# Altium project 20211009_EleksTube_IPS_V1.2.PrjPCB
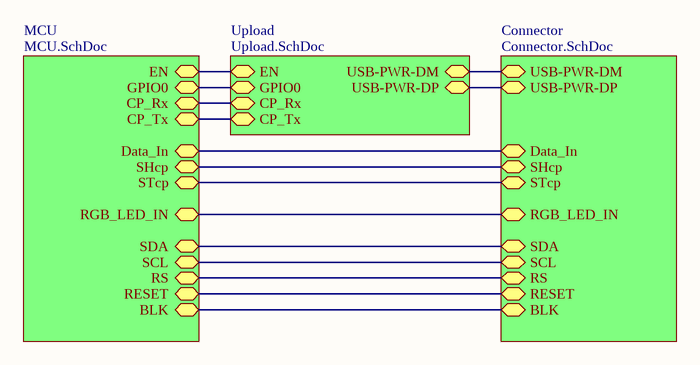
[diagram p0: 20211009_EleksTube_IPS_V1.2.SchDoc]
4 sheets, 43 parts. Net scope: hierarchical (ports join the sheet entries above them; power ports are global).
Board file: 20211009_EleksTube_IPS_V1.2.PcbDoc
Sheets:
  20211009_EleksTube_IPS_V1.2.SchDoc
    MCU = MCU.SchDoc
    Connector = Connector.SchDoc
    Upload = Upload.SchDoc

## Sheet 20211009_EleksTube_IPS_V1.2.SchDoc
size A4

### Sub-sheets
Connector = Connector.SchDoc: USB-PWR-DM, USB-PWR-DP, SDA, SCL, RS, RESET, Data_In, SHcp, STcp, RGB_LED_IN, BLK
MCU = MCU.SchDoc: EN, GPIO0, CP_Rx, CP_Tx, Data_In, SHcp, STcp, SDA, SCL, RS, RESET, RGB_LED_IN, BLK
Upload = Upload.SchDoc: EN, GPIO0, USB-PWR-DM, USB-PWR-DP, CP_Rx, CP_Tx

### Nets
BLK: sheet MCU/BLK, sheet Connector/BLK
CP_Rx: sheet MCU/CP_Rx, sheet Upload/CP_Rx
CP_Tx: sheet MCU/CP_Tx, sheet Upload/CP_Tx
Data_In: sheet MCU/Data_In, sheet Connector/Data_In
DC: sheet MCU/RS, sheet Connector/RS
EN: sheet MCU/EN, sheet Upload/EN
GPIO0: sheet MCU/GPIO0, sheet Upload/GPIO0
GPIO12: sheet MCU/RGB_LED_IN, sheet Connector/RGB_LED_IN
GPIO16: sheet MCU/SHcp, sheet Connector/SHcp
GPIO17: sheet MCU/STcp, sheet Connector/STcp
GPIO18: sheet MCU/SCL, sheet Connector/SCL
GPIO23: sheet MCU/SDA, sheet Connector/SDA
GPIO26: sheet MCU/RESET, sheet Connector/RESET
USB-PWR-DM: sheet Connector/USB-PWR-DM, sheet Upload/USB-PWR-DM
USB-PWR-DP: sheet Connector/USB-PWR-DP, sheet Upload/USB-PWR-DP

## Sheet MCU.SchDoc
size A4
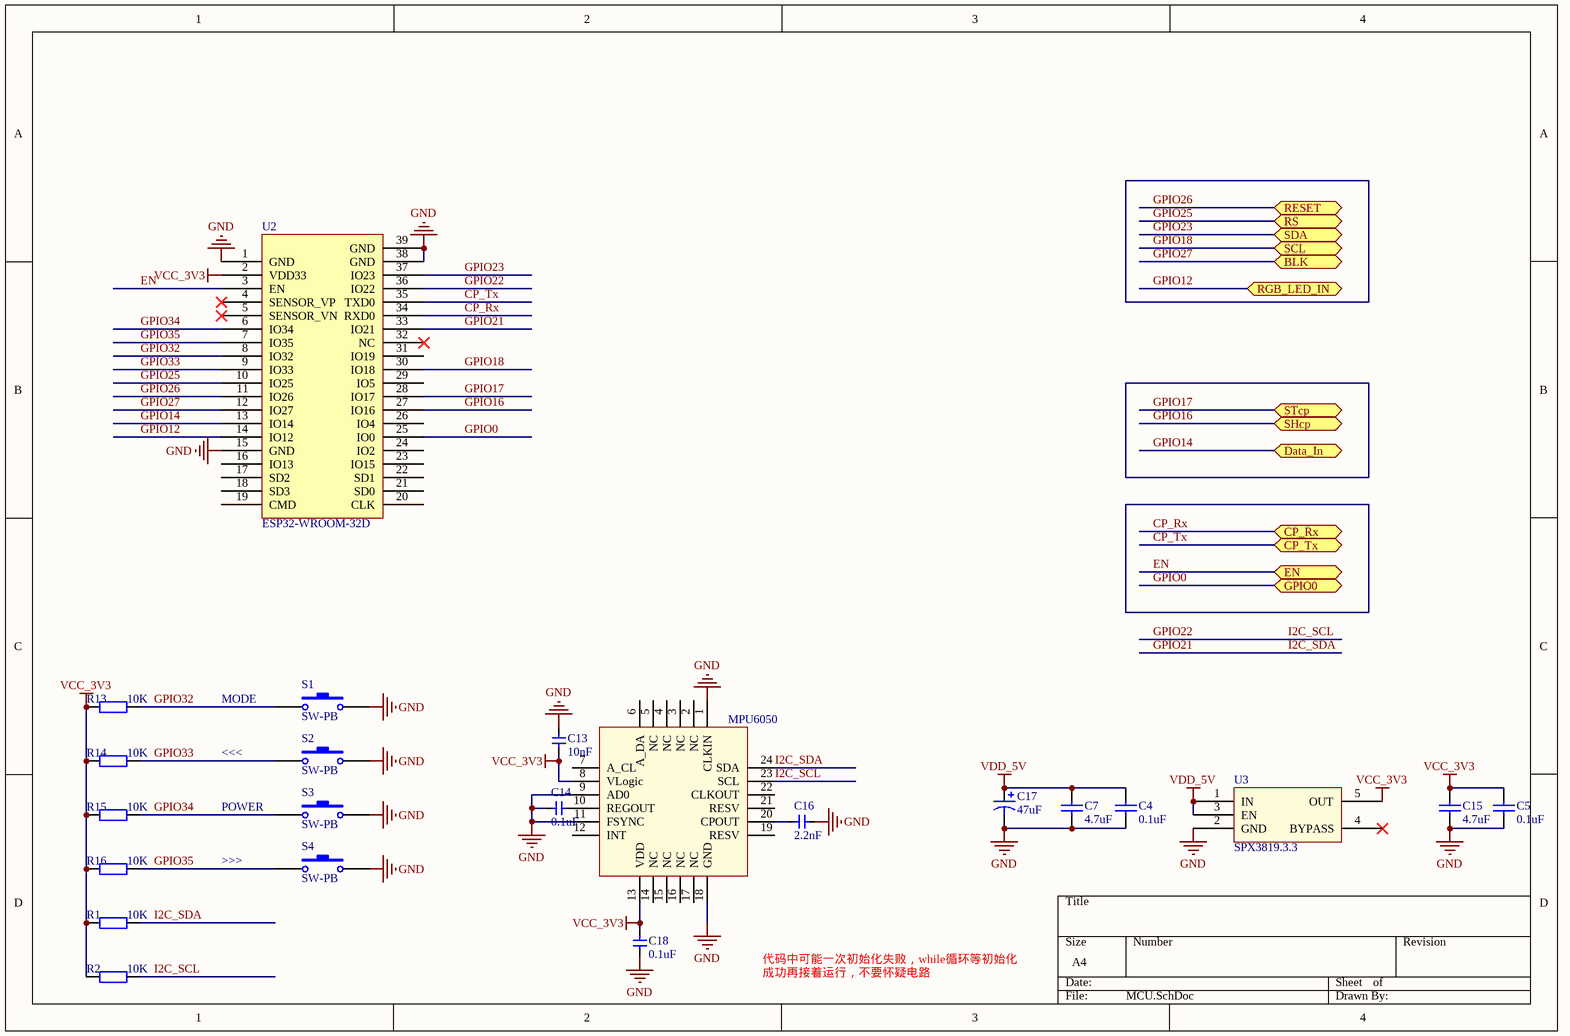
[diagram p1: MCU.SchDoc]

### Parts
C4  0.1uF  [C0603]
C5  0.1uF  [C0603]
C7  4.7uF  [C0603]
C13  10nF  [C0603]
C14  0.1uF  [C0603]
C15  4.7uF  [C0603]
C16  2.2nF  [C0603]
C17  47uF  [6032-C/P]
C18  0.1uF  [C0603]
R1  10K  [R0603]
R2  10K  [R0603]
R13  10K  [R0603]
R14  10K  [R0603]
R15  10K  [R0603]
R16  10K  [R0603]
S1  SW-PB  [6*6*6]
S2  SW-PB  [6*6*6]
S3  SW-PB  [6*6*6]
S4  SW-PB  [6*6*6]
U2  ESP32-WROOM-32D  [ESP32-WROOM-32D]
U3  SPX3819.3.3  [SOT23-5]
U6  MPU6050  [QFN-24]

### Ports
BLK, CP_Rx, CP_Tx, Data_In, EN, GPIO0, RESET, RGB_LED_IN, RS, SCL, SDA, SHcp, STcp

### Nets
GND: C4.2 C5.2 C7.2 C13.2 C14.2 C15.2 C16.1 C17.2 C18.1 S1.2 S2.2 S3.2 S4.2 U2.1(GND) U2.15(GND) U2.38(GND) U2.39(GND) U3.2(GND) U6.1(CLKIN) U6.9(AD0) U6.11(FSYNC) U6.18(GND)
VCC_3V3: C5.1 C13.1 C15.1 C18.2 R1.1 R2.1 R13.1 R14.1 R15.1 R16.1 U2.2(VDD33) U3.5(OUT) U6.8(VLogic) U6.13(VDD)
VDD_5V: C4.1 C7.1 C17.1 U3.1(IN) U3.3(EN)
CP_Rx: U2.34(RXD0) ; port CP_Rx
CP_Tx: U2.35(TXD0) ; port CP_Tx
EN: U2.3(EN) ; port EN
GPIO0: U2.25(IO0) ; port GPIO0
GPIO12: U2.14(IO12) ; port RGB_LED_IN
GPIO14: U2.13(IO14) ; port Data_In  [project net Data_In]
GPIO16: U2.27(IO16) ; port SHcp
GPIO17: U2.28(IO17) ; port STcp
GPIO18: U2.30(IO18) ; port SCL
GPIO21: R1.2 U2.33(IO21) U6.24(SDA)  [also labelled I2C_SDA]
GPIO22: R2.2 U2.36(IO22) U6.23(SCL)  [also labelled I2C_SCL]
GPIO23: U2.37(IO23) ; port SDA
GPIO25: U2.10(IO25) ; port RS  [project net DC]
GPIO26: U2.11(IO26) ; port RESET
GPIO27: U2.12(IO27) ; port BLK  [project net BLK]
GPIO32: R13.2 S1.1 U2.8(IO32)
GPIO33: R14.2 S2.1 U2.9(IO33)
GPIO34: R15.2 S3.1 U2.6(IO34)
GPIO35: R16.2 S4.1 U2.7(IO35)
NetC14_1: C14.1 U6.10(REGOUT)
NetC16_2: C16.2 U6.20(CPOUT)

Not connected (* = marked no-connect by the designer): U2 4(SENSOR_VP)* 5(SENSOR_VN)* 16(IO13) 17(SD2) 18(SD3) 19(CMD) 20(CLK) 21(SD0) 22(SD1) 23(IO15) 24(IO2) 26(IO4) 29(IO5) 31(IO19) 32(NC)*; U3 4(BYPASS)*; U6 2(NC) 3(NC) 4(NC) 5(NC) 6(A_DA) 7(A_CL) 12(INT) 14(NC) 15(NC) 16(NC) 17(NC) 19(RESV) 21(RESV) 22(CLKOUT)

### Notes on the sheet
- MODE
- <<<
- POWER
- >>>
- 代码中可能一次初始化失败，while循环等初始化成功再接着运行，不要怀疑电路

### Library data of the parts
C4 C5 C7 C15 = Cap: Capacitor; Value: 1.0uF/50V; Published: 8-Jun-2000; LatestRevisionDate: 17-Jul-2002; LatestRevisionNote: Re-released for DXP Platform.; PackageReference: RAD-0.3; Publisher: Altium Limited; PackageDescription: Radial Cap, Thru-Hole; 2 Leads; 0.3 in Pin Spacing
C13 C14 C16 C18 = 电容-0402: Capacitor; Value: 0.1u
C17 = Cap Pol1: Polarized Capacitor (Radial); Value: 100pF; Published: 8-Jun-2000; LatestRevisionDate: 17-Jul-2002; LatestRevisionNote: Re-released for DXP Platform.; PackageReference: RB7.6-15; Publisher: Altium Limited; PackageDescription: Polarized Capacitor (Radial); 2 Leads
R1 R2 R13-R16 = Res: 电阻; Value: 1K; Published: 8-Jun-2000; LatestRevisionDate: 17-Jul-2002; LatestRevisionNote: Re-released for DXP Platform.; PackageReference: R0603; Publisher: Altium Limited
S1-S4 = SW-PB: Switch; Published: 24-Mar-1999; LatestRevisionDate: 17-Jul-2002; LatestRevisionNote: Re-released for DXP Platform.; PackageReference: SPST-2; Publisher: Altium Limited; PackageDescription: Switch; 2 Leads
U3 = SPX3819.3.3: LDO
U6 = MPU6050: 六轴传感器

## Sheet Connector.SchDoc
size A4
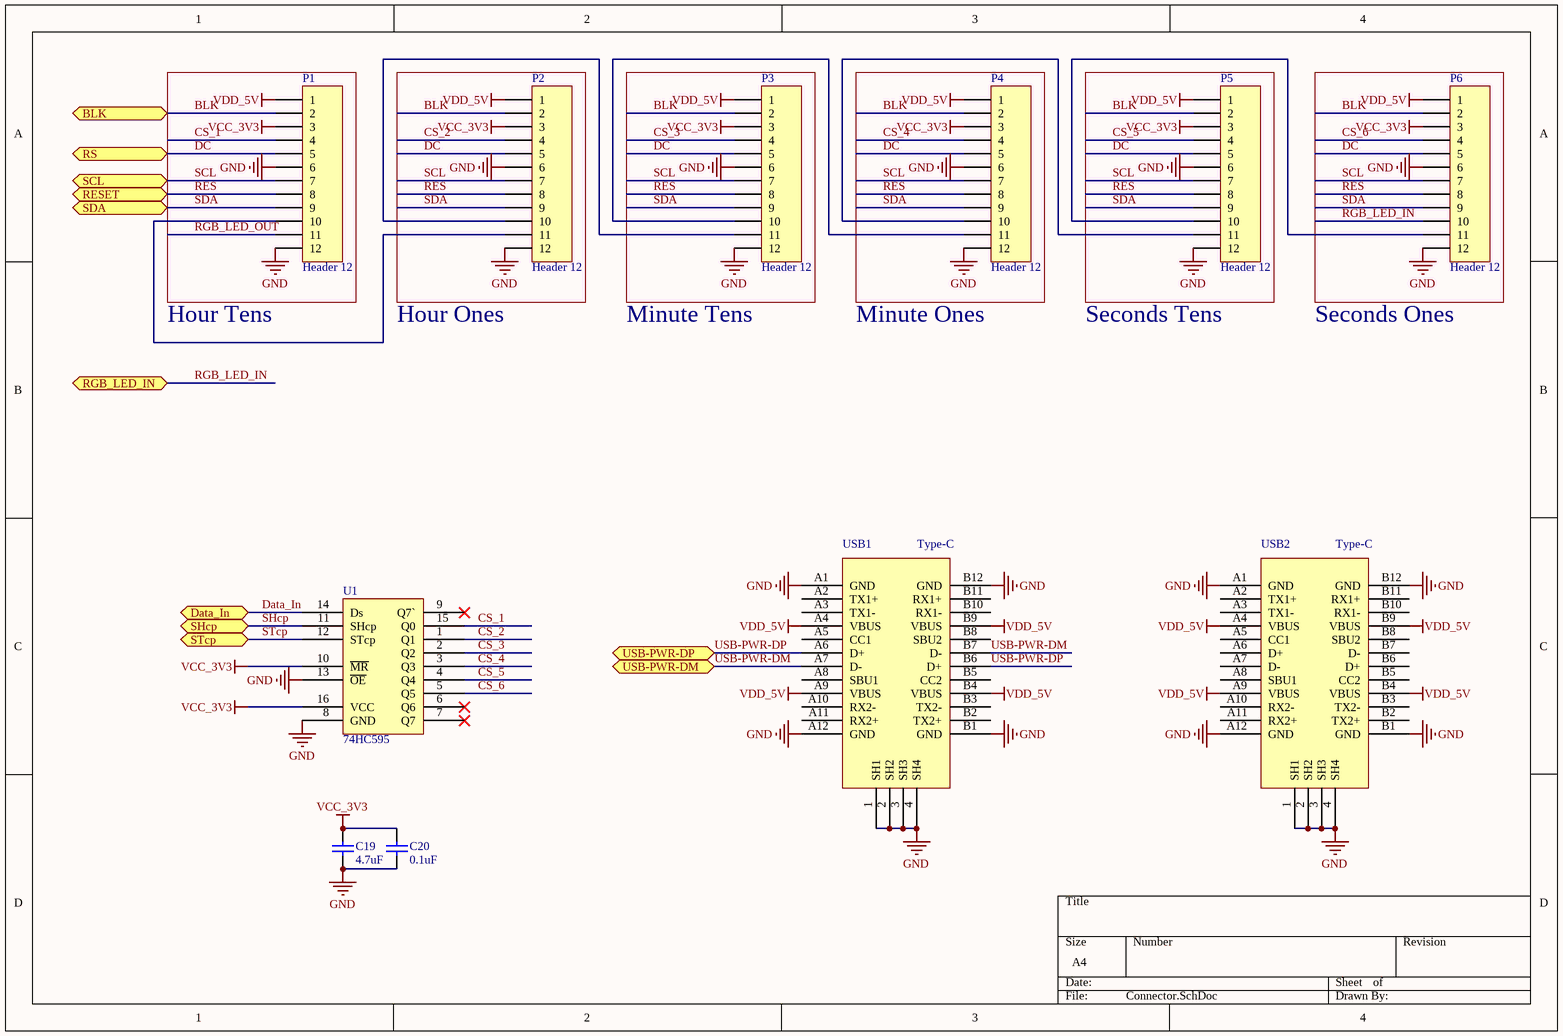
[diagram p2: Connector.SchDoc]

### Parts
C19  4.7uF  [C0603]
C20  0.1uF  [C0603]
P1  Header 12  [SIP12-1.27]
P2  Header 12  [SIP12-1.27]
P3  Header 12  [SIP12-1.27]
P4  Header 12  [SIP12-1.27]
P5  Header 12  [SIP12-1.27]
P6  Header 12  [SIP12-1.27]
U1  74HC595  [SO-16_L]
USB1  Type-C  [Type-C-TOP]
USB2  Type-C  [Type-C-TOP]

### Ports
BLK, Data_In, RESET, RGB_LED_IN, RS, SCL, SDA, SHcp, STcp, USB-PWR-DM, USB-PWR-DP

### Nets
GND: C19.2 C20.2 P1.6 P1.12 P2.6 P2.12 P3.6 P3.12 P4.6 P4.12 P5.6 P5.12 P6.6 P6.12 U1.8(GND) U1.13(~{OE}) USB1.1(SH1) USB1.2(SH2) USB1.3(SH3) USB1.4(SH4) USB1.A1(GND) USB1.A12(GND) USB1.B1(GND) USB1.B12(GND) USB2.1(SH1) USB2.2(SH2) USB2.3(SH3) USB2.4(SH4) USB2.A1(GND) USB2.A12(GND) USB2.B1(GND) USB2.B12(GND)
VCC_3V3: C19.1 C20.1 P1.3 P2.3 P3.3 P4.3 P5.3 P6.3 U1.10(~{MR}) U1.16(VCC)
VDD_5V: P1.1 P2.1 P3.1 P4.1 P5.1 P6.1 USB1.A4(VBUS) USB1.A9(VBUS) USB1.B4(VBUS) USB1.B9(VBUS) USB2.A4(VBUS) USB2.A9(VBUS) USB2.B4(VBUS) USB2.B9(VBUS)
BLK: P1.2 P2.2 P3.2 P4.2 P5.2 P6.2 ; port BLK
CS_1: P1.4 U1.15(Q0)
CS_2: P2.4 U1.1(Q1)
CS_3: P3.4 U1.2(Q2)
CS_4: P4.4 U1.3(Q3)
CS_5: P5.4 U1.4(Q4)
CS_6: P6.4 U1.5(Q5)
Data_In: U1.14(Ds) ; port Data_In
DC: P1.5 P2.5 P3.5 P4.5 P5.5 P6.5 ; port RS
RES: P1.8 P2.8 P3.8 P4.8 P5.8 P6.8 ; port RESET  [project net GPIO26]
RGB_LED_IN: P6.10 ; port RGB_LED_IN  [project net GPIO12]
RGB_LED_OUT: P1.11
SCL: P1.7 P2.7 P3.7 P4.7 P5.7 P6.7 ; port SCL  [project net GPIO18]
SDA: P1.9 P2.9 P3.9 P4.9 P5.9 P6.9 ; port SDA  [project net GPIO23]
SHcp: U1.11(SHcp) ; port SHcp  [project net GPIO16]
STcp: U1.12(STcp) ; port STcp  [project net GPIO17]
USB-PWR-DM: USB1.A7(D-) USB1.B7(D-) ; port USB-PWR-DM
USB-PWR-DP: USB1.A6(D+) USB1.B6(D+) ; port USB-PWR-DP
NetP1_10: P1.10 P2.11
NetP2_10: P2.10 P3.11
NetP3_10: P3.10 P4.11
NetP4_10: P4.10 P5.11
NetP5_10: P5.10 P6.11

Not connected (* = marked no-connect by the designer): U1 6(Q6)* 7(Q7)* 9(Q7`)*; USB1 A2(TX1+) A3(TX1-) A5(CC1) A8(SBU1) A10(RX2-) A11(RX2+) B2(TX2+) B3(TX2-) B5(CC2) B8(SBU2) B10(RX1-) B11(RX1+); USB2 A2(TX1+) A3(TX1-) A5(CC1) A6(D+) A7(D-) A8(SBU1) A10(RX2-) A11(RX2+) B2(TX2+) B3(TX2-) B5(CC2) B6(D+) B7(D-) B8(SBU2) B10(RX1-) B11(RX1+)

### Notes on the sheet
- Hour Tens
- Hour Ones
- Minute Tens
- Minute Ones
- Seconds Tens
- Seconds Ones

### Library data of the parts
C19 C20 = Cap: Capacitor; Value: 1.0uF/50V; Published: 8-Jun-2000; LatestRevisionDate: 17-Jul-2002; LatestRevisionNote: Re-released for DXP Platform.; PackageReference: RAD-0.3; Publisher: Altium Limited; PackageDescription: Radial Cap, Thru-Hole; 2 Leads; 0.3 in Pin Spacing
P1-P6 = Header 12: Header, 12-Pin; LatestRevisionDate: 17-Jul-2002; LatestRevisionNote: Re-released for DXP Platform.; Publisher: Altium Limited
USB1 USB2 = USB-Type-C-TOP

## Sheet Upload.SchDoc
size A4
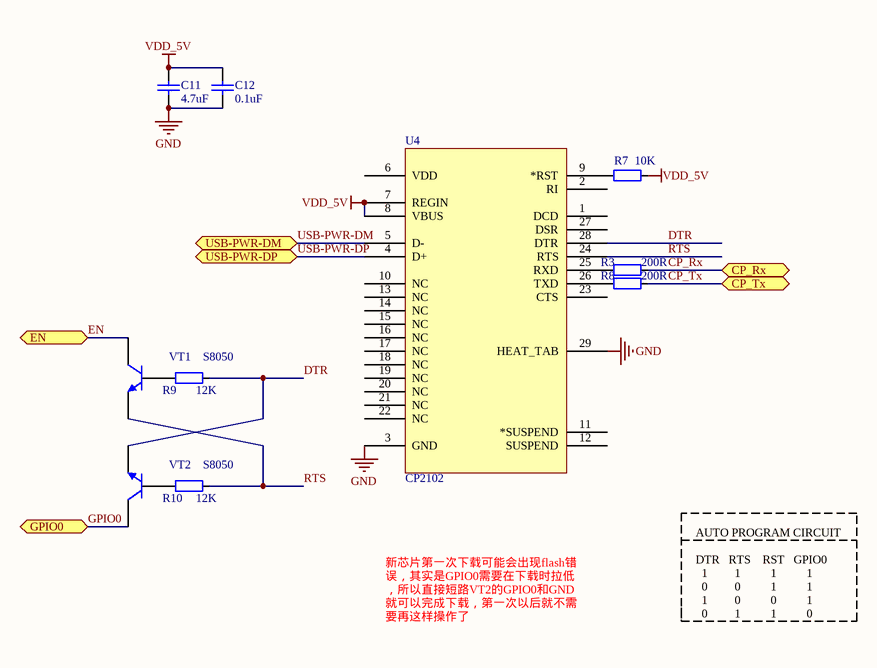
[diagram p3: Upload.SchDoc]

### Parts
C11  4.7uF  [C0603]
C12  0.1uF  [C0603]
R3  200R  [R0603]
R7  10K  [R0603]
R8  200R  [R0603]
R9  12K  [R0603]
R10  12K  [R0603]
U4  CP2102  [QFN-28]
VT1  S8050  [SMT_TRIODE_NPN]
VT2  S8050  [SMT_TRIODE_NPN]

### Ports
CP_Rx, CP_Tx, EN, GPIO0, USB-PWR-DM, USB-PWR-DP

### Nets
GND: C11.2 C12.2 U4.3(GND) U4.29(HEAT_TAB)
VDD_5V: C11.1 C12.1 R7.1 U4.7(REGIN) U4.8(VBUS)
CP_Rx: R3.1 ; port CP_Rx
CP_Tx: R8.1 ; port CP_Tx
DTR: R9.1 U4.28(DTR) VT2.2(E)
EN: VT1.3(C) ; port EN
GPIO0: VT2.3(C) ; port GPIO0
RTS: R10.1 U4.24(RTS) VT1.2(E)
USB-PWR-DM: U4.5(D-) ; port USB-PWR-DM
USB-PWR-DP: U4.4(D+) ; port USB-PWR-DP
NetR3_2: R3.2 U4.25(RXD)
NetR7_2: R7.2 U4.9(*RST)
NetR8_2: R8.2 U4.26(TXD)
NetR9_2: R9.2 VT1.1(B)
NetR10_2: R10.2 VT2.1(B)

Not connected (* = marked no-connect by the designer): U4 1(DCD) 2(RI) 6(VDD) 10(NC) 11(*SUSPEND) 12(SUSPEND) 13(NC) 14(NC) 15(NC) 16(NC) 17(NC) 18(NC) 19(NC) 20(NC) 21(NC) 22(NC) 23(CTS) 27(DSR)

### Notes on the sheet
- AUTO PROGRAM CIRCUIT
  DTR   RTS    RST   GPIO0
  1         1          1          1
  0         0          1          1
  1         0          0          1
  0         1          1          0
- 新芯片第一次下载可能会出现flash错误，其实是GPIO0需要在下载时拉低，所以直接短路VT2的GPIO0和GND就可以完成下载，第一次以后就不需要再这样操作了

### Library data of the parts
C11 C12 = Cap: Capacitor; Value: 1.0uF/50V; Published: 8-Jun-2000; LatestRevisionDate: 17-Jul-2002; LatestRevisionNote: Re-released for DXP Platform.; PackageReference: RAD-0.3; Publisher: Altium Limited; PackageDescription: Radial Cap, Thru-Hole; 2 Leads; 0.3 in Pin Spacing
R3 R7-R10 = 电阻-0402: Resistor; Value: 22R
U4 = CP2102: USB转TTL; PART DESC: SINGLE-CHIP USB TO UART BRIDGE, QFN28, RoHS.; MFG #1: SILICON LABS; PART NUMBER: CP2102; Value: Value; RefDes: RefDes; Type: DEV
VT1 VT2 = SMT_TRIODE_NPN: Surface mount NPN transistor, package SOT-23

## Nets that join several sheets
GND: MCU (22 pins), Connector (32 pins), Upload (C11.2 C12.2 U4.3 U4.29)
VCC_3V3: MCU (14 pins), Connector (10 pins)
VDD_5V: MCU (5 pins), Connector (14 pins), Upload (5 pins)
BLK: MCU (U2.12), Connector (6 pins)
CP_Rx: MCU (U2.34), Upload (R3.1)
CP_Tx: MCU (U2.35), Upload (R8.1)
Data_In: MCU (U2.13), Connector (U1.14)
DC: MCU (U2.10), Connector (6 pins)
EN: MCU (U2.3), Upload (VT1.3)
GPIO0: MCU (U2.25), Upload (VT2.3)
GPIO12: MCU (U2.14), Connector (P6.10)
GPIO16: MCU (U2.27), Connector (U1.11)
GPIO17: MCU (U2.28), Connector (U1.12)
GPIO18: MCU (U2.30), Connector (6 pins)
GPIO23: MCU (U2.37), Connector (6 pins)
GPIO26: MCU (U2.11), Connector (6 pins)
USB-PWR-DM: Connector (USB1.A7 USB1.B7), Upload (U4.5)
USB-PWR-DP: Connector (USB1.A6 USB1.B6), Upload (U4.4)